# EAGLE design electrotactile_fanout (EAGLE 9.1.0)
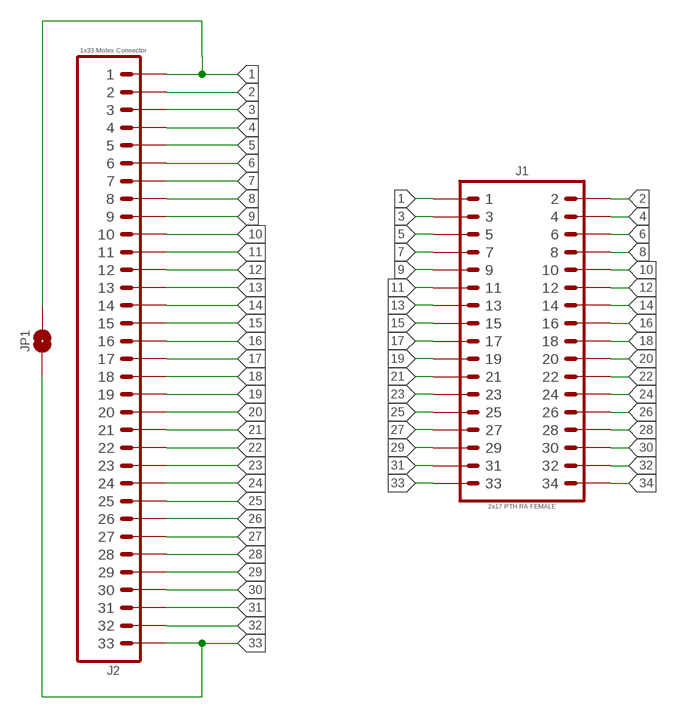
[diagram p0: schematic, sheet 1]

## Parts
J1  2x17 PTH RA FEMALE  2X17_PTH_RA-FEMALE  [2X17-RA-FEMALE]
J2  1x33 Molex Connector  1X33_MOLEX_FPC_FPC_RIBBON-CABLE  [_MOLEX-5025983393_FPC_PITCH-0.3MM]
JP1  JUMPER_SMD_2-PAD_NO_SILK  [SMT-JUMPER_2_NO_SILK]

## Nets
1: J1.1 J2.P$1 JP1.2
2: J1.2 J2.P$2
3: J1.3 J2.P$3
4: J1.4 J2.P$4
5: J1.5 J2.P$5
6: J1.6 J2.P$6
7: J1.7 J2.P$7
8: J1.8 J2.P$8
9: J1.9 J2.P$9
10: J1.10 J2.P$10
11: J1.11 J2.P$11
12: J1.12 J2.P$12
13: J1.13 J2.P$13
14: J1.14 J2.P$14
15: J1.15 J2.P$15
16: J1.16 J2.P$16
17: J1.17 J2.P$17
18: J1.18 J2.P$18
19: J1.19 J2.P$19
20: J1.20 J2.P$20
21: J1.21 J2.P$21
22: J1.22 J2.P$22
23: J1.23 J2.P$23
24: J1.24 J2.P$24
25: J1.25 J2.P$25
26: J1.26 J2.P$26
27: J1.27 J2.P$27
28: J1.28 J2.P$28
29: J1.29 J2.P$29
30: J1.30 J2.P$30
31: J1.31 J2.P$31
32: J1.32 J2.P$32
33: J1.33 J2.P$33 JP1.1
34: J1.34

## Library data of the parts
J1 = PiB_connectors:2X17; DATASHEET: http://suddendocs.samtec.com/prints/ssq-1xx-xx-xxx-x-xx-xxx-xx-x-mkt.pdf; DIST: Digikey; DISTLINK: https://www.digikey.com/products/en?keywords=SAM1224-17-ND; DISTPN: SAM1224-17-ND; MFR: Samtec Inc.; MPN: SSQ-117-02-T-D-RA
J2 = PiB_connectors:1X33_MOLEX_FPC; DATASHEET: https://www.molex.com/pdm_docs/sd/5025982593_sd.pdf; DATASHEET_CABLE: https://www.molex.com/pdm_docs/sd/150150423_sd.pdf; DIST: Digikey; DISTLINK: https://www.digikey.com/products/en?keywords=WM9775CT-ND; DISTLINK_CABLE: https://www.digikey.com/products/en?keywords=WM9647-ND; DISTPN: WM9775CT-ND; DISTPN_CABLE: WM9647-ND; DIST_CABLE: Digikey; MFR: Molex, LLC; MFR_CABLE: Molex, LLC; MPN: 5025983393; MPN_CABLE: 0150150233
JP1 = PiB_connectors:JUMPER_SMD_2-PAD_NO: Normally open jumper

## Board
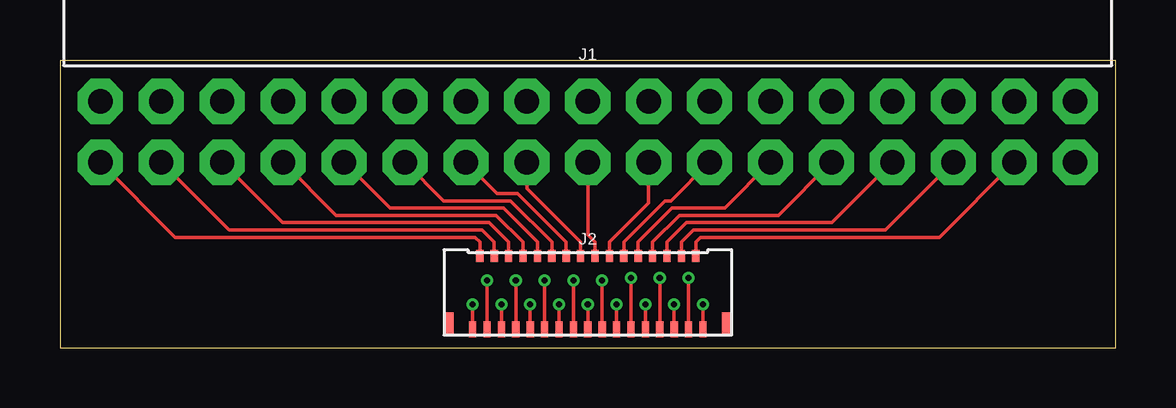
[diagram p1: board, top side]
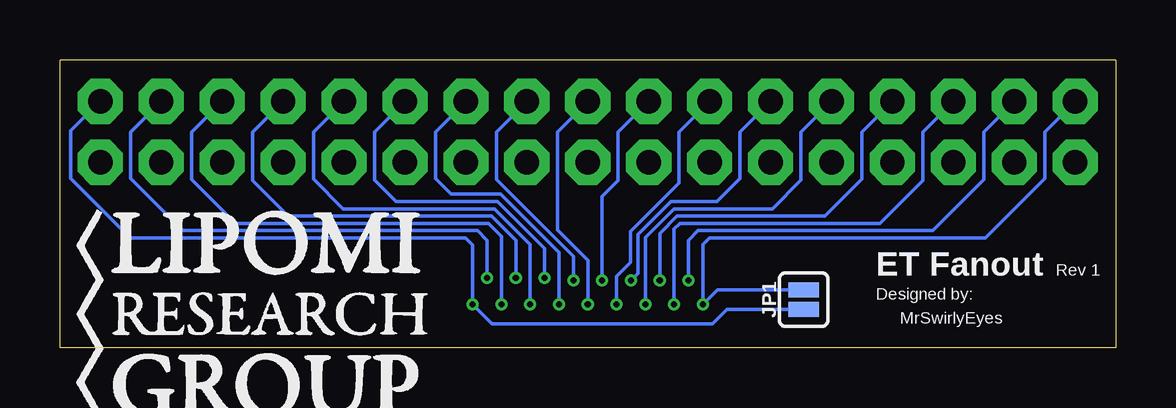
[diagram p2: board, bottom side, seen from below]

Size 44 x 12 mm. Coordinates in mm from the lower left corner, seen from the top.
Outline: 44,0 44,12 0,12 0,0 44,0
Copper layers (1*16): Top 0.035559375mm / dielectric 1.6mm / Bottom 0.035559375mm
Design rules "oshpark-2layer": minimum track width 6mil, minimum drill 10mil, track to track 6mil, track to pad 6mil, pad to pad 6mil, via to via 6mil, smd to smd 6mil, copper to edge 15mil, drill to drill 6mil, minimum pad ring 5mil, minimum via ring 5mil, stop-mask expansion 2.5mil, vias tented up to drill 0mil, thermal gap 10mil

### Footprints (pad centres in the part's own frame; a part is rotated, then mirrored left to right if it is on the bottom)
2X17-RA-FEMALE = drill 1.016 pad 1.88 octagon: 1 20.32,-1.27; 2 20.32,1.27; 3 17.78,-1.27; 4 17.78,1.27; 5 15.24,-1.27; 6 15.24,1.27; 7 12.7,-1.27; 8 12.7,1.27; 9 10.16,-1.27; 10 10.16,1.27; 11 7.62,-1.27; 12 7.62,1.27; 13 5.08,-1.27; 14 5.08,1.27; 15 2.54,-1.27; 16 2.54,1.27; 17 0,-1.27; 18 0,1.27; 19 -2.54,-1.27; 20 -2.54,1.27; 21 -5.08,-1.27; 22 -5.08,1.27; 23 -7.62,-1.27; 24 -7.62,1.27; 25 -10.16,-1.27; 26 -10.16,1.27; 27 -12.7,-1.27; 28 -12.7,1.27; 29 -15.24,-1.27; 30 -15.24,1.27; 31 -17.78,-1.27; 32 -17.78,1.27; 33 -20.32,-1.27; 34 -20.32,1.27
_MOLEX-5025983393_FPC_PITCH-0.3MM = smd 0.3 x 0.67: P$1 -4.8,-1.532; P$3 -4.2,-1.532; P$5 -3.6,-1.532; P$7 -3,-1.532; P$9 -2.4,-1.532; P$11 -1.8,-1.532; P$13 -1.2,-1.532; P$15 -0.6,-1.532; P$17 0,-1.532; P$19 0.6,-1.532; P$21 1.2,-1.532; P$23 1.8,-1.532; P$25 2.4,-1.532; P$27 3,-1.532; P$29 3.6,-1.532; P$31 4.2,-1.532; P$33 4.8,-1.532 | smd 0.3 x 0.5: P$2 -4.5,1.532; P$4 -3.9,1.532; P$6 -3.3,1.532; P$8 -2.7,1.532; P$10 -2.1,1.532; P$12 -1.5,1.532; P$14 -0.9,1.532; P$16 -0.3,1.532; P$18 0.3,1.532; P$20 0.9,1.532; P$22 1.5,1.532; P$24 2.1,1.532; P$26 2.7,1.532; P$28 3.3,1.532; P$30 3.9,1.532; P$32 4.5,1.532 | smd 0.35 x 1: P$34 -5.775,-1.325; P$35 5.775,-1.325
SMT-JUMPER_2_NO_SILK = smd 0.635 x 1.27: 1 -0.406,0; 2 0.406,0

### Placement (x,y rotation side)
J1  22,9 180 top
J2  22,2.3 0 top
JP1  13,2 90 bottom
U$1  [LRG-LOGO]  36,1.4 0 bottom

### Tracks (layer width: path | path; a pad name or v marks a point on that pad's centre or on a via)
1  (via drill 0.25)
  Top 0.152: J2.P$1 v17.2,1.8
  Bottom 0.152: J1.1 2.95,9 2.95,7.05 5.43,4.57 16.93,4.57 17.2,4.3 v17.2,1.8 16.59,2.41 JP1.2
2
  Top 0.152: J2.P$2 17.5,4.4 17.3,4.6 4.81,4.6 J1.2
3  (via drill 0.25)
  Top 0.152: J2.P$3 v17.8,2.8
  Bottom 0.152: J1.3 5.49,9 5.49,7.01 7.62,4.88 17.4,4.88 17.8,4.48 v17.8,2.8
4
  Top 0.152: J2.P$4 18.1,4.4 17.59,4.91 7.04,4.91 J1.4
5  (via drill 0.25)
  Top 0.152: J2.P$5 v18.4,1.8
  Bottom 0.152: J1.5 8.03,9 8.03,6.97 9.82,5.18 18.16,5.18 18.4,4.94 v18.4,1.8
6
  Top 0.152: J2.P$6 18.7,4.4 17.89,5.21 9.28,5.21 J1.6
7  (via drill 0.25)
  Top 0.152: J2.P$7 v19,2.8
  Bottom 0.152: J1.7 10.57,9 10.57,7.03 12.11,5.49 18.28,5.49 19,4.77 v19,2.8
8
  Top 0.152: J2.P$8 19.3,4.4 18.19,5.51 11.52,5.51 J1.8
9  (via drill 0.25)
  Top 0.152: J2.P$9 v19.6,1.8
  Bottom 0.152: J1.9 13.11,9 13.11,7.27 13.11,6.99 14.31,5.79 18.41,5.79 19.6,4.6 v19.6,1.8
10
  Top 0.152: J2.P$10 19.9,4.4 18.48,5.82 13.75,5.82 J1.10
11  (via drill 0.25)
  Top 0.152: J2.P$11 v20.2,2.8
  Bottom 0.152: J1.11 15.65,9 15.65,7.05 16.61,6.1 18.54,6.1 19.91,4.73 19.91,3.09 v20.2,2.8
12
  Top 0.152: J2.P$12 20.5,4.4 18.78,6.12 15.99,6.12 J1.12
13  (via drill 0.25)
  Top 0.152: J2.P$13 v20.8,1.8
  Bottom 0.152: J1.13 18.19,9 18.19,6.87 20.21,4.85 20.21,3.56 20.8,2.97 v20.8,1.8
14
  Top 0.152: J2.P$14 21.1,4.4 19.07,6.43 18.22,6.43 J1.14
15  (via drill 0.25)
  Top 0.152: J2.P$15 v21.4,2.8
  Bottom 0.152: J1.15 20.73,9 20.73,6.97 21.4,6.3 v21.4,2.8
16
  Top 0.152: J2.P$16 21.7,4.4 19.46,6.64 J1.16
17  (via drill 0.25)
  Top 0.152: J2.P$17 v22,1.8
  Bottom 0.152: J1.17 23.27,9 23.27,7 23.27,6.97 23.27,4.9 22,3.63 v22,1.8
18
  Top 0.152: J2.P$18 22.3,4.4 22,4.7 J1.18
19  (via drill 0.25)
  Top 0.152: J2.P$19 v22.6,2.8
  Bottom 0.152: J1.19 25.81,9 25.81,7.01 22.6,3.8 v22.6,2.8
20
  Top 0.152: J2.P$20 22.9,4.4 24.54,6.04 J1.20
21  (via drill 0.25)
  Top 0.152: J2.P$21 v23.2,1.8
  Bottom 0.152: J1.21 28.35,9 28.35,7.05 27.7,6.4 25.63,6.4 23.2,3.97 v23.2,1.8
22
  Top 0.152: J2.P$22 23.5,4.4 25.22,6.12 25.47,6.12 J1.22
23  (via drill 0.25)
  Top 0.152: J2.P$23 v23.8,2.9
  Bottom 0.152: J1.23 30.89,9 30.89,6.99 30,6.1 25.76,6.1 23.8,4.14 v23.8,2.9
24
  Top 0.152: J2.P$24 24.1,4.4 25.52,5.82 27.71,5.82 J1.24
25  (via drill 0.25)
  Top 0.152: J2.P$25 v24.4,1.8
  Bottom 0.152: J1.25 33.43,9 33.43,7.03 32.19,5.79 25.88,5.79 24.4,4.31 v24.4,1.8
26
  Top 0.152: J2.P$26 24.7,4.4 25.81,5.51 29.94,5.51 J1.26
27  (via drill 0.25)
  Top 0.152: J2.P$27 v25,2.9
  Bottom 0.152: J1.27 35.97,9 35.97,6.97 34.49,5.49 26.01,5.49 25,4.48 v25,2.9
28
  Top 0.152: J2.P$28 25.3,4.4 26.11,5.21 32.18,5.21 J1.28
29  (via drill 0.25)
  Top 0.152: J2.P$29 v25.6,1.8
  Bottom 0.152: J1.29 38.51,9 38.51,7.01 36.68,5.18 26.14,5.18 25.6,4.64 v25.6,1.8
30
  Top 0.152: J2.P$30 25.9,4.4 26.41,4.91 34.41,4.91 J1.30
31  (via drill 0.25)
  Top 0.152: J2.P$31 v26.2,2.9
  Bottom 0.152: J1.31 41.05,9 41.05,7.05 38.88,4.88 26.6,4.88 26.2,4.48 v26.2,2.9
32
  Top 0.152: J2.P$32 26.5,4.4 26.7,4.6 36.65,4.6 J1.32
33  (via drill 0.25)
  Top 0.152: J2.P$33 v26.8,1.8
  Bottom 0.152: J1.33 43.54,9.05 43.54,7.04 41.07,4.57 27.1,4.57 26.8,4.27 v26.8,1.8 26,1 16.8,1 16.21,1.59 JP1.1

### Text on the board
bPlace: Rev 1 | ET Fanout | Designed by: | MrSwirlyEyes